# Altium schematic sheet 03_Power.SchDoc
size A4; SheetNumber: 3; SheetTotal: 5
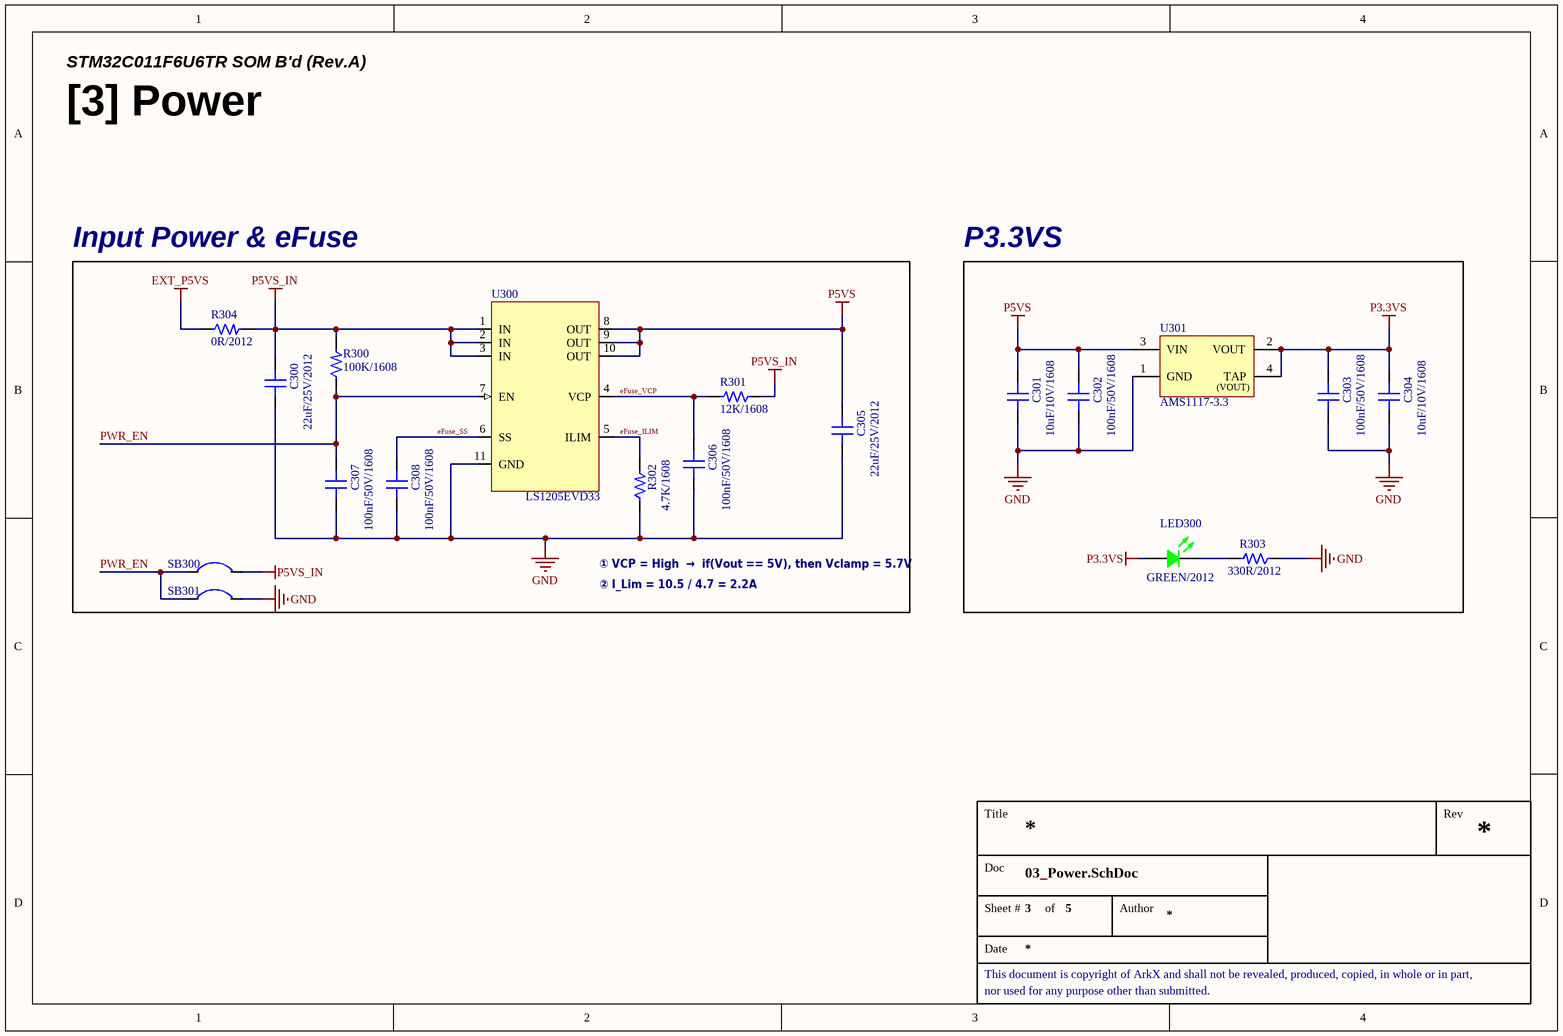
[diagram p0: 03_Power.SchDoc]

## Parts
C300  22uF/25V/2012  [CAP 2012 (0805_INCH)]
C301  10uF/10V/1608  [CAP 1608 (0603_INCH)]
C302  100nF/50V/1608  [CAP 1608 (0603_INCH)]
C303  100nF/50V/1608  [CAP 1608 (0603_INCH)]
C304  10uF/10V/1608  [CAP 1608 (0603_INCH)]
C305  22uF/25V/2012  [CAP 2012 (0805_INCH)]
C306  100nF/50V/1608  [CAP 1608 (0603_INCH)]
C307  100nF/50V/1608  [CAP 1608 (0603_INCH)]
C308  100nF/50V/1608  [CAP 1608 (0603_INCH)]
LED300  GREEN/2012  [LED MHT170RGBCT (GREEN)]
R300  100K/1608  [RES 1608 (0603_inch)]
R301  12K/1608  [RES 1608 (0603_inch)]
R302  4.7K/1608  [RES 1608 (0603_inch)]
R303  330R/2012  [RES 2012 (0805_inch)]
R304  0R/2012  [RES 2012 (0805_inch)]
SB300  SB  [SB (Solder-Bridge)]  (value not drawn)
SB301  SB  [SB (Solder-Bridge)]  (value not drawn)
U300  LS1205EVD33  [IC_DFN_3x3_10L]
U301  AMS1117-3.3  [SOT 223-3 (DIODES INCORPORATED)]

## Blocks framed on the sheet
Input Power & eFuse: C300 C305-C308 R300-R302 R304 SB300 SB301 U300
P3.3VS: C301-C304 LED300 R303 U301

## Nets
EXT_P5VS: R304.1
GND: C300.1 C301.1 C302.1 C303.1 C304.1 C305.1 C306.1 C307.1 C308.1 R302.1 R303.1 SB301.2 U300.11(GND) U301.1(GND)
P3.3VS: C303.2 C304.2 LED300.4(Common_Anode) U301.2(VOUT) U301.4(TAP)
P5VS: C301.2 C302.2 C305.2 U300.8(OUT) U300.9(OUT) U300.10(OUT) U301.3(VIN)
P5VS_IN: C300.2 R300.2 R301.1 R304.2 SB300.2 U300.1(IN) U300.2(IN) U300.3(IN)
eFuse_ILIM: R302.2 U300.5(ILIM)
eFuse_SS: C308.2 U300.6(SS)
eFuse_VCP: C306.2 R301.2 U300.4(VCP)
PWR_EN: C307.2 R300.1 SB300.1 SB301.1 U300.7(EN)
NetLED300_2: LED300.2(GREEN) R303.2

## Notes on the sheet
- STM32C011F6U6TR SOM B'd (Rev.A)
- [3] Power
- ① VCP = High  →  if(Vout == 5V), then Vclamp = 5.7V
- ② I_Lim = 10.5 / 4.7 = 2.2A
- Title
- Rev
- Doc
- Sheet #
- of
- Author
- This document is copyright of ArkX and shall not be revealed, produced, copied, in whole or in part,
- Date
- nor used for any purpose other than submitted.
- (in symbol IC_REG_AMS1117-3.3) (VOUT)

## Library data of the parts
C300 C305 = CAP_22uF/25V/2012: Ceramic CAP_22uF/25V/2012; LCSC Part #: C45783; JLCPCB Part Type: Basic Part
C301 C304 = CAP_10uF/10V/1608: Ceramic CAP_10uF/10V/1608; LCSC Part #: C19702; JLCPCB Part Type: Basic Part
C302 C303 C306-C308 = CAP_100nF/50V/1608: Ceramic CAP_100nF/50V/1608; LCSC Part #: C14663; JLCPCB Part Type: Basic Part
LED300 = LED_MHT170RGBCT(GREEN): Colorless transparence -30℃~+85℃ Positive post Common anode RGB 120° 0805  Light Emitting Diodes (LED) ROHS; LCSC Part #: C2962094; JLCPCB Part Type: Extended Part
R300 = RES_100K/1608/0.1W: Value: 100K; Power Rating: 0.1W; Precision: 1%; Size: 1608; LCSC Part #: C25803; JLCPCB Part Type: Basic Part
R301 = RES_12K/1608/0.1W: Value: 12K; Power Rating: 0.1W; Precision: 1%; Size: 1608; LCSC Part #: C22790; JLCPCB Part Type: Basic Part
R302 = RES_4.7K/1608/0.1W: Value: 4.7K; Power Rating: 0.1W; Precision: 1%; Size: 1608; LCSC Part #: C23162; JLCPCB Part Type: Basic Part
R303 = RES_330R/2012/0.125W: Value: 330R; Power Rating: 0.125W; Precision: 1%; Size: 2012; LCSC Part #: C17630; JLCPCB Part Type: Basic Part
R304 = RES_0R/2012/0.125W: Value: 0R; Power Rating: 0.1W; Precision: 1%; Size: 1608; LCSC Part #: C17477; JLCPCB Part Type: Basic Part
SB300 SB301 = SB_Solder-Bridge
U300 = IC_eFUSE_LS1205EVD33: 18V, 5A eFuse with Programmable Current Limit and Output Voltage Clamp, 10-DFN (3x3)
U301 = IC_REG_AMS1117-3.3: 72dB@(120Hz) 1A 1.3V@(800mA) Fixed 3.3V~3.3V Positive 1 SOT-223  Linear Voltage Regulators (LDO) ROHS; LCSC Part #: C6186; JLCPCB Part Type: Basic Part